# EAGLE schematic Motor PCB (EAGLE 9.2.2)
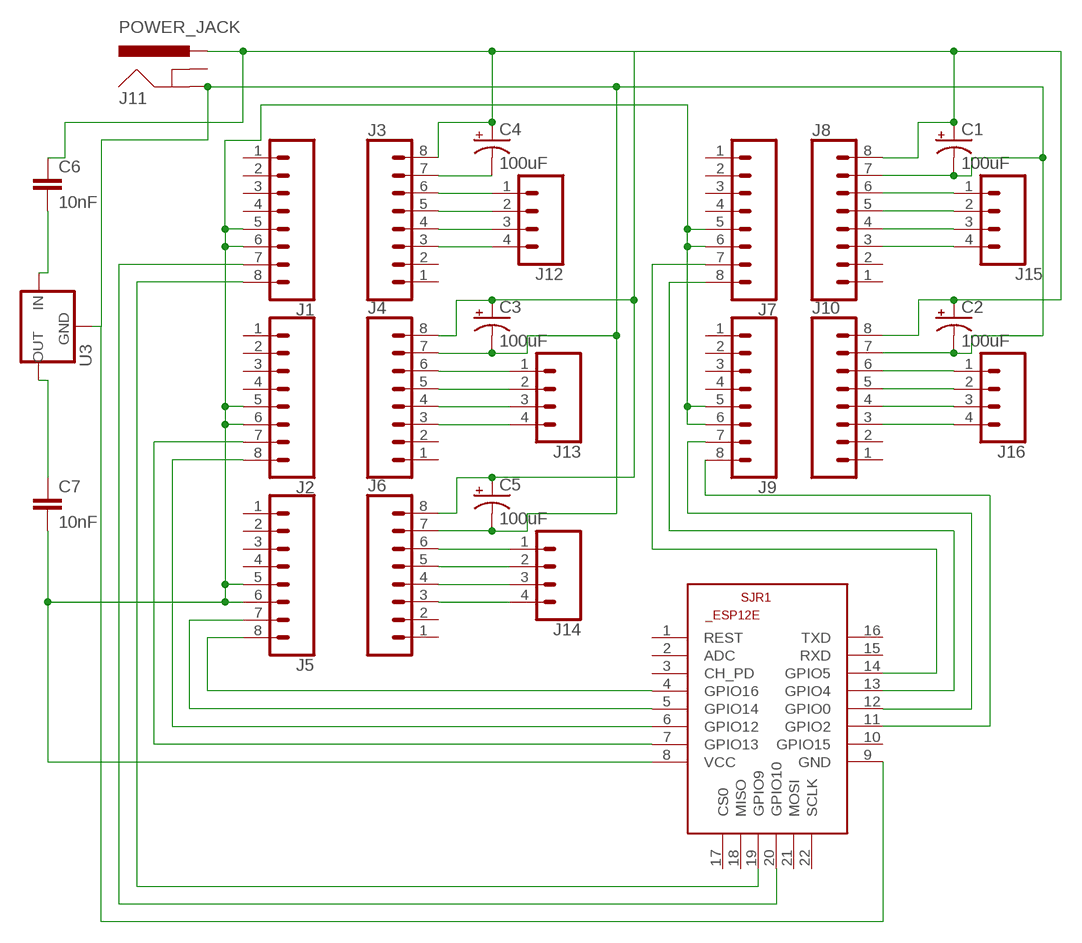
[diagram p0: schematic, sheet 1]

## Parts
C1  100uF  100UF-POLAR-EIA7343-16V-10%(TANT)  [EIA7343]
C2  100uF  100UF-POLAR-EIA7343-16V-10%(TANT)  [EIA7343]
C3  100uF  100UF-POLAR-EIA7343-16V-10%(TANT)  [EIA7343]
C4  100uF  100UF-POLAR-EIA7343-16V-10%(TANT)  [EIA7343]
C5  100uF  100UF-POLAR-EIA7343-16V-10%(TANT)  [EIA7343]
C6  10nF  10NF-0603-50V-10%  [0603]
C7  10nF  10NF-0603-50V-10%  [0603]
J1  CONN_08"  [1X08]
J2  CONN_08"  [1X08]
J3  CONN_08"  [1X08]
J4  CONN_08"  [1X08]
J5  CONN_08"  [1X08]
J6  CONN_08"  [1X08]
J7  CONN_08"  [1X08]
J8  CONN_08"  [1X08]
J9  CONN_08"  [1X08]
J10  CONN_08"  [1X08]
J11  POWER_JACK  [POWER_JACK_PTH]
J12  CONN_04JST-PTH-VERT  [JST-4-PTH-VERT]
J13  CONN_04JST-PTH-VERT  [JST-4-PTH-VERT]
J14  CONN_04JST-PTH-VERT  [JST-4-PTH-VERT]
J15  CONN_04JST-PTH-VERT  [JST-4-PTH-VERT]
J16  CONN_04JST-PTH-VERT  [JST-4-PTH-VERT]
SJR1  ESP8266-12EESP12E  [ESP8266-ESP12E]
U3  V_REG_78XX-TO-220  [TO-220-ALT]

## Nets
N$1: C1.A(+) C2.A(+) C3.A(+) C4.A(+) C5.A(+) C6.1 J3.8 J4.8 J6.8 J8.8 J10.8 J11.PWR
N$2: J4.6 J13.1
N$3: J9.8 SJR1.11(GPIO2)
N$4: J9.7 SJR1.12(GPIO0)
N$5: J7.8 SJR1.13(GPIO4)
N$6: C4.C(-) J3.7
N$7: J7.7 SJR1.14(GPIO5)
N$8: J1.7 SJR1.20(GPIO10)
N$9: J1.8 SJR1.19(GPIO9)
N$10: J2.7 SJR1.7(GPIO13)
N$11: J2.8 SJR1.6(GPIO12)
N$12: J5.7 SJR1.5(GPIO14)
N$13: J5.8 SJR1.4(GPIO16)
N$14: J3.6 J12.1
N$15: J3.5 J12.2
N$16: J3.4 J12.3
N$17: J3.3 J12.4
N$18: C1.C(-) C2.C(-) C3.C(-) C5.C(-) J4.7 J6.7 J8.7 J10.7 J11.GND SJR1.9(GND) U3.GND
N$19: J4.5 J13.2
N$20: J4.4 J13.3
N$21: J4.3 J13.4
N$22: J6.6 J14.1
N$23: J6.5 J14.2
N$24: J6.4 J14.3
N$25: J6.3 J14.4
N$26: J8.6 J15.1
N$27: J8.5 J15.2
N$28: J8.4 J15.3
N$29: J8.3 J15.4
N$30: J10.6 J16.1
N$31: J10.5 J16.2
N$32: J10.4 J16.3
N$33: J10.3 J16.4
N$34: C6.2 U3.IN
N$35: C7.1 U3.OUT
N$36: C7.2 J1.5 J1.6 J2.5 J2.6 J5.5 J5.6 J7.5 J7.6 J9.5 J9.6 SJR1.8(VCC)
Unconnected: J1.1 J1.2 J1.3 J1.4 J2.1 J2.2 J2.3 J2.4 J3.1 J3.2 J4.1 J4.2 J5.1 J5.2 J5.3 J5.4 J6.1 J6.2 J7.1 J7.2 J7.3 J7.4 J8.1 J8.2 J9.1 J9.2 J9.3 J9.4 J10.1 J10.2 J11.GNDBREAK SJR1.1(REST) SJR1.2(ADC) SJR1.3(CH_PD) SJR1.10(GPIO15) SJR1.15(RXD) SJR1.16(TXD) SJR1.17(CS0) SJR1.18(MISO) SJR1.21(MOSI) SJR1.22(SCLK)

## Library data of the parts
C1-C5 = SparkFun-Capacitors:100UF-POLAR: 100µF polarized capacitors A capacitor is a passive two-terminal electrical component used to store electrical energy temporarily in an electric field.; PROD_ID: CAP-08702
C6 C7 = SparkFun-Capacitors:10NF: 0.01uF/10nF/10,000pF ceramic capacitors A capacitor is a passive two-terminal electrical component used to store electrical energy temporarily in an electric field. CAP-09321; PROD_ID: CAP-00867
J1-J10 = SparkFun-Connectors:CONN_08: Multi connection point. Often used as Generic Header-pin footprint for 0.1 inch spaced/style header connections On any of the 0.1 inch spaced packages, you can populate with these: Break Away Headers - Straight <https://www.sparkfun.com/products/116> (PRT-00116) Break Away Male Headers - Right Angle <https://www.sparkfun.com/products/553> (PRT-00553) Female Headers <https://www.sparkfun.com/products/115> (PRT-00115) Break Away Headers - Machine Pin <https://www.sparkfun.com/products/117> (PRT-00117) Break Away Female Headers - Swiss Machine Pin <https://www.sparkfun.com/products/743> (PRT-00743) Arduino Stackable Header - 8 Pin <https://www.sparkfun.com/products/9279> (PRT-09279) For SCREWTERMINALS and SPRING TERMINALS visit here: Screw Terimnals on SparkFun.com <https://www.sparkfun.com/search/results?term=Screw+Terminals> (5mm/3.5mm/2.54mm spacing) This device is also useful as a general connection point to wire up your design to another part of your project. Our various solder wires solder well into these plated through hole pads. Hook-Up Wire - Assortment (Stranded, 22 AWG) <https://www.sparkfun.com/products/11375> (PRT-11375) Hook-Up Wire - Assortment (Solid Core, 22 AWG) <https://www.sparkfun.com/products/11367> (PRT-11367) View the entire wire category on our website here <https://www.sparkfun.com/categories/141> Special notes: Molex polarized connector foot print use with SKU : PRT-08231 with associated crimp pins and housings. 1MM SMD Version SKU: PRT-10208 NOTES ON THE VARIANTS LOCK and LOCK_LONGPADS... This footprint was designed to help hold the alignment of a through-hole component (i.e. 6-pin header) while soldering it into place. You may notice that each hole has been shifted either up or down by 0.005 of an inch from it's more standard position (which is a perfectly straight line). This slight alteration caused the pins (the squares in the middle) to touch the edges of the holes. Because they are alternating, it causes a "brace" to hold the component in place. 0.005 has proven to be the perfect amount of "off-center" position when using our standard breakaway headers. Although looks a little odd when you look at the bare footprint, once you have a header in there, the alteration is very hard to notice. Also,if you push a header all the way into place, it is covered up entirely on the bottom side.; PROD_ID: CONN-08438
J11 = SparkFun-Connectors:POWER_JACK: Power Jack Connector This is the standard 5.5mm barrel jack for power. The PTH is the most common, proven, reliable, footprint. The Slot footprint only works if the mill layer is transmitted to the PCB fab house so be warned. Here are the connectors we sell at SparkFun: DC Barrel Power Jack/Connector <https://www.sparkfun.com/products/119> (PRT-00119) DC Barrel Power Jack/Connector (SMD) <https://www.sparkfun.com/products/12748> (PRT-12748) DC Barrel Jack Adapter - Breadboard Compatible <https://www.sparkfun.com/products/10811> (PRT-10811) It is used on this SparkFun product (and many, many others): SparkFun RedBoard - Programmed with Arduino <https://www.sparkfun.com/products/12757> (DEV-12757) Also, if you need a mating power supply or connector, please check these out: Wall Adapter Power Supply - 9VDC 650mA <https://www.sparkfun.com/products/298> (TOL-00298) DC Barrel Jack Adapter - Male <https://www.sparkfun.com/products/10287> (PRT-10287); PROD_ID: CONN-08197
J12-J16 = SparkFun-Connectors:CONN_04: Multi connection point. Often used as Generic Header-pin footprint for 0.1 inch spaced/style header connections On any of the 0.1 inch spaced packages, you can populate with these: Break Away Headers - Straight <https://www.sparkfun.com/products/116> (PRT-00116) Break Away Male Headers - Right Angle <https://www.sparkfun.com/products/553> (PRT-00553) Female Headers <https://www.sparkfun.com/products/115> (PRT-00115) Break Away Headers - Machine Pin <https://www.sparkfun.com/products/117> (PRT-00117) Break Away Female Headers - Swiss Machine Pin <https://www.sparkfun.com/products/743> (PRT-00743) For SCREWTERMINALS and SPRING TERMINALS visit here: Screw Terimnals on SparkFun.com <https://www.sparkfun.com/search/results?term=Screw+Terminals> (5mm/3.5mm/2.54mm spacing) This device is also useful as a general connection point to wire up your design to another part of your project. Our various solder wires solder well into these plated through hole pads. Hook-Up Wire - Assortment (Stranded, 22 AWG) <https://www.sparkfun.com/products/11375> (PRT-11375) Hook-Up Wire - Assortment (Solid Core, 22 AWG) <https://www.sparkfun.com/products/11367> (PRT-11367) View the entire wire category on our website here <https://www.sparkfun.com/categories/141> Special notes: Molex polarized connector foot print use with SKU : PRT-08231 with associated crimp pins and housings. 1MM SMD Version SKU: PRT-10208; PROD_ID: CONN-13251
SJR1 = esp12e:ESP8266-12E: ESP8266-12E Library for Eagle CAD The author not responsible for any damages or errors!. Created by Suhail jr.lt;/author>
U3 = SparkFun-IC-Power:V_REG_78XX: Voltage Regulator Standard 78xx regulator. IGO (Input Ground Output). Spark Fun Electronics SKU : COM-00107; PROD_ID: VREG-08450; SF_ID: COM-00107